# EAGLE schematic 8s_Cell_Fixtures (EAGLE 5.12)
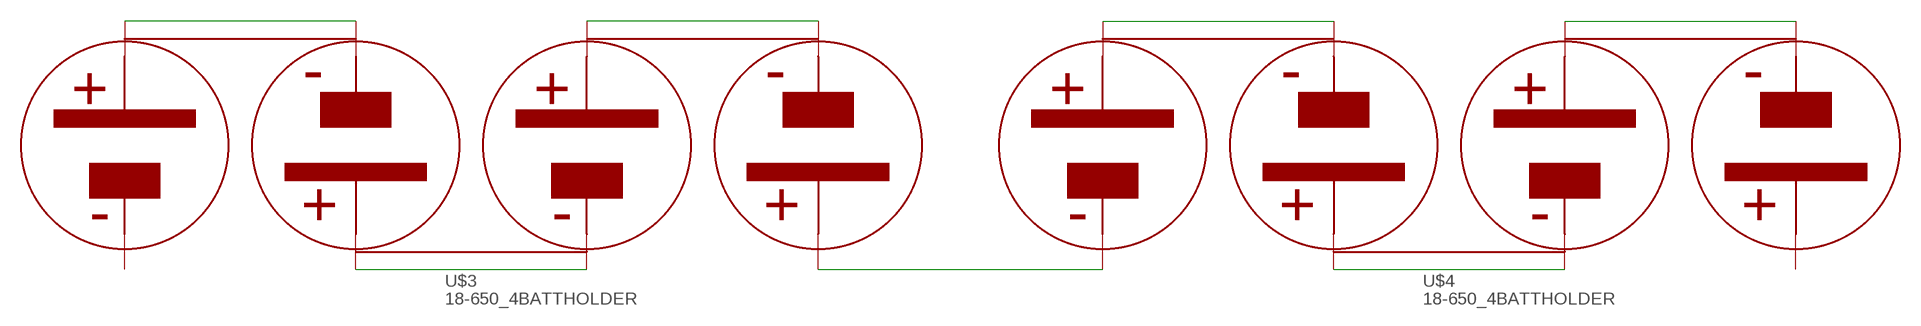
[diagram p0: schematic, sheet 1]

## Parts
U$3  18-650_4BATTHOLDER  [18650-4BATT]
U$4  18-650_4BATTHOLDER  [18650-4BATT]

## Nets
N$1: U$3.BATT+2 U$3.BATT-3
N$2: U$3.BATT+3 U$3.BATT-4
N$3: U$3.BATT+4 U$4.BATT-1
N$4: U$3.BATT+1 U$3.BATT-2
N$5: U$4.BATT+1 U$4.BATT-2
N$6: U$4.BATT+2 U$4.BATT-3
N$7: U$4.BATT+3 U$4.BATT-4
Unconnected: U$3.BATT-1 U$4.BATT+4

## Library data of the parts
U$3 U$4 = MPD:18-650_4BATTHOLDER: Datasheet: http://www.memoryprotectiondevices.com/datasheets/BK-18650-PC8-datasheet.pdf Used in 18-650 cell fixtures 12/3/14; PARTNO: BK-18650-PC8